# Altium schematic sheet MCU.SchDoc
size A
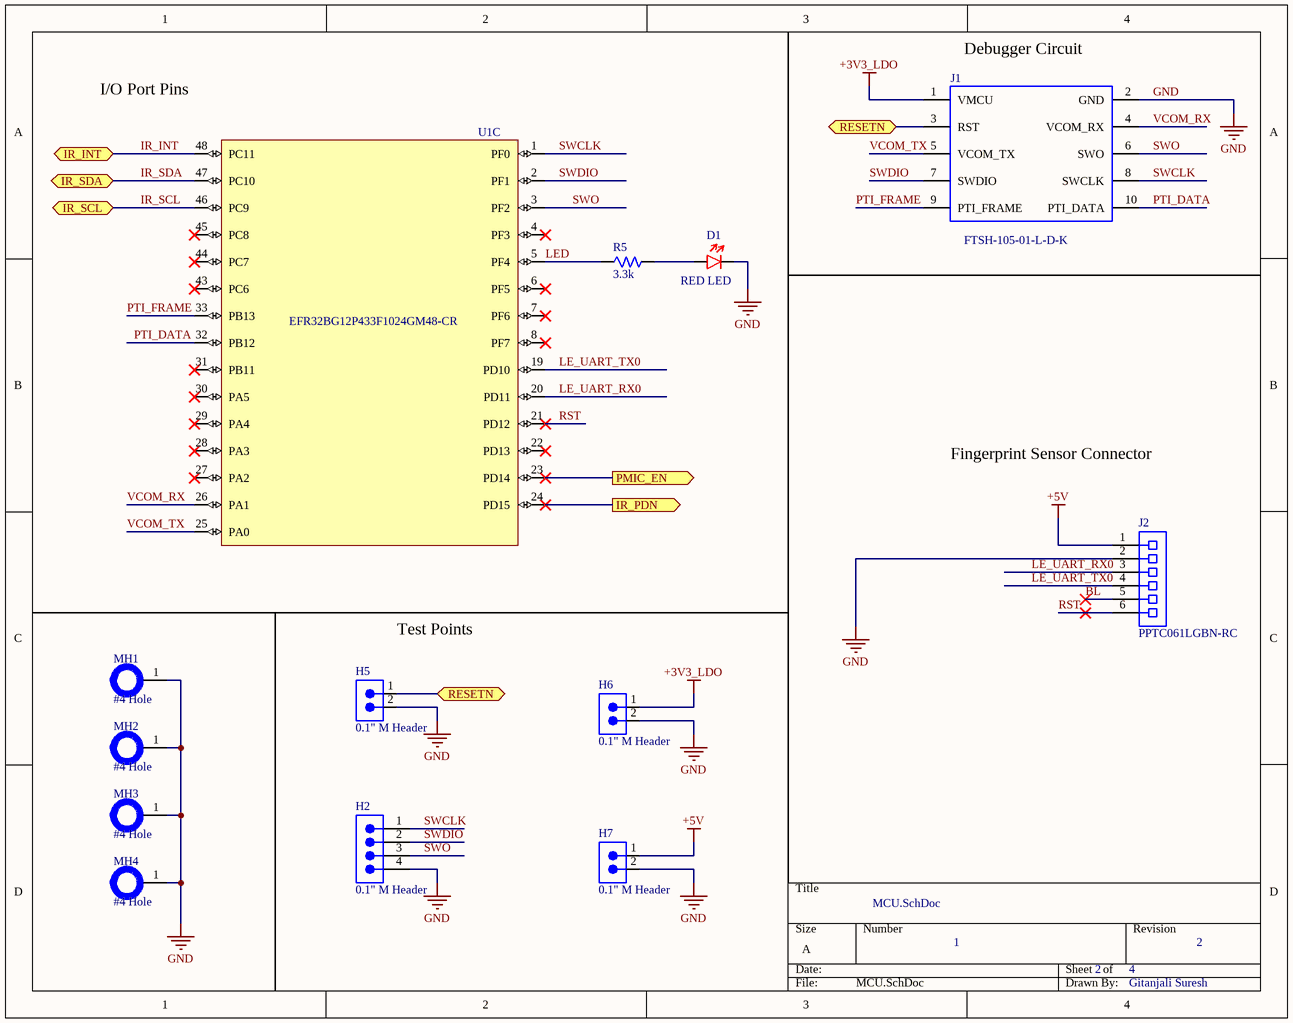
[diagram p0: MCU.SchDoc]

## Parts
D1  RED LED  [LED_0603_GRN_WL-SMCW]
H2  0.1" M Header  [4-PIN_MALE_HEADER_01-IN]
H5  0.1" M Header  [77311-118-02LF_AMP]
H6  0.1" M Header  [77311-118-02LF_AMP]
H7  0.1" M Header  [77311-118-02LF_AMP]
J1  FTSH-105-01-L-D-K  [SAMTEC_FTSH-105-01-L-D-K]
J2  PPTC061LGBN-RC  [SAMTEC-SSQ-106-02-X-S-RA]
MH1  #4 Hole  [HOLE_#4]  (no BOM)
MH2  #4 Hole  [HOLE_#4]  (no BOM)
MH3  #4 Hole  [HOLE_#4]  (no BOM)
MH4  #4 Hole  [HOLE_#4]  (no BOM)
R5  3.3k  [RES_0603_3.3k]
U1  EFR32BG12P433F1024GM48-CR  [QFN50P700X700X90_HS-49N]  (part C of 3)

## Ports
IR_INT (bidir), IR_PDN (out), IR_SCL (bidir), IR_SDA (bidir), PMIC_EN (out), RESETN (bidir)

## Nets
+3V3_LDO: H6.1 J1.1(VMCU)
+5V: H7.1 J2.1(VCC)
GND: D1.2 H2.4 H5.2 H6.2 H7.2 J1.2(GND) J2.2(GND) MH1.1 MH2.1 MH3.1 MH4.1
BL: J2.5(BL)
IR_INT: U1.48(PC11) ; port IR_INT
IR_PDN: U1.24(PD15) ; port IR_PDN
IR_SCL: U1.46(PC9) ; port IR_SCL
IR_SDA: U1.47(PC10) ; port IR_SDA
LE_UART_RX0: J2.3(TXD) U1.20(PD11)
LE_UART_TX0: J2.4(RXD) U1.19(PD10)
LED: R5.1 U1.5(PF4)
PMIC_EN: U1.23(PD14) ; port PMIC_EN
PTI_DATA: J1.10(PTI_DATA) U1.32(PB12)
PTI_FRAME: J1.9(PTI_FRAME) U1.33(PB13)
RESETN: H5.1 J1.3(RST) ; port RESETN
RST: J2.6(RST) U1.21(PD12)
SWCLK: H2.1 J1.8(SWCLK) U1.1(PF0)
SWDIO: H2.2 J1.7(SWDIO) U1.2(PF1)
SWO: H2.3 J1.6(SWO) U1.3(PF2)
VCOM_RX: J1.4(VCOM_RX) U1.26(PA1)
VCOM_TX: J1.5(VCOM_TX) U1.25(PA0)
NetD1_1: D1.1 R5.2

Not connected (* = marked no-connect by the designer): U1 4(PF3)* 6(PF5)* 7(PF6)* 8(PF7)* 22(PD13)* 27(PA2)* 28(PA3)* 29(PA4)* 30(PA5)* 31(PB11)* 43(PC6)* 44(PC7)* 45(PC8)*

## Notes on the sheet
- I/O Port Pins
- (near J1) Debugger Circuit
- Fingerprint Sensor Connector
- Test Points
- 1
- 2
- 4
- Gitanjali Suresh

## Library data of the parts
D1 = L1CU-RED1000000000: LED LUXEON CZ RED SMD; Manufacturer: Wurth Electronics; Manufacturer Part Number: 150060GS75000; Color: Green; Wavelength: 520nm; Viewing Angle: 140°; Lens Style: Clear,Rectangular; Luminous Intensity: 430mcd; Forward Current: 30mA; Forward Voltage: 3.2V; Test Current: 20mA; RoHS: Yes; Category: LEDs; Stock 1: 94535; Pricing 1: 1=0.14000, 50=0.13300, 100=0.11400, 500=0.09900 (USD); Mount: Surface Mount; Case/Package: 0603; Case Code (Metric): 1608; Case Code (Imperial): 0603; Min Operating Temperature: -40°C; Max Operating Temperature: 85°C; Package Quantity: 4000; Packaging: Tape and Reel; Dominant Wavelength: 520nm; Length: 1.6mm; Height: 0.7mm; Width: 0.8mm; REACH SVHC: Unknown; Lead Free: Lead Free; ComponentLink1URL: https://datasheet.ciiva.com/29562/150060gs75000-29562868.pdf?src-supplier=Digi-Key; ComponentLink1Description: https://datasheet.ciiva.com/29562/150060gs75000-29562868.pdf?src-supplier=Digi-Key; ComponentLink2URL: https://datasheet.ciiva.com/29279/759427-da-01-en-chipled-0603-w-kl-gruen-150060gs75000-29279201.pdf?src-supplier=Conrad; ComponentLink2Description: https://datasheet.ciiva.com/29279/759427-da-01-en-chipled-0603-w-kl-gruen-150060gs75000-29279201.pdf?src-supplier=Conrad; ComponentLink3URL: https://datasheet.ciiva.com/29562/150060gs75000-29562870.pdf?src-supplier=Digi-Key; ComponentLink3Description: https://datasheet.ciiva.com/29562/150060gs75000-29562870.pdf?src-supplier=Digi-Key; ComponentLink4URL: https://datasheet.ciiva.com/29562/150060gs75000-29562869.pdf?src-supplier=Digi-Key; ComponentLink4Description: https://datasheet.ciiva.com/29562/150060gs75000-29562869.pdf?src-supplier=Digi-Key; Supplier 1: Digi-Key; Supplier Part Number 1: 1416-2040-1-ND
H2 = PRPC004SAAN-RC: CONN HEADER VERT 4POS 2.54MM; Manufacturer: Sullins; Connector Type: Header, Unshrouded, Breakaway; Number of Positions: 4; Number of Positions Loaded: All; Pitch: 0.100" (2.54mm); Online Catalog: 0.100" (2.54mm) Pitch Connector Headers; Other Names: S9510E-04  S9510E-04-ND; Supplier 1: Digi-Key; Manufacturer Part Number: PRPC004SAAN-RC; Stock 1: 6306; Pricing 1: 1=0.15, 10=0.146, 25=0.1084, 50=0.0928, 100=0.0898, 250=0.0774, 500=0.0743 (USD); Standard Package: 1; Category: Connectors, Interconnects; Family: Rectangular Connectors - Headers, Male Pins; Series: -; Packaging: Bulk; Contact Type: Male Pin; Number of Rows: 1; Row Spacing: -; Contact Mating Length: 0.230" (5.84mm); Mounting Type: Through Hole; Termination: Solder; Fastening Type: -; Features: -; Contact Finish: Gold; Contact Finish Thickness: Flash; Color: Black; ComponentLink1URL: https://media.digikey.com/PDF/Data%20Sheets/Sullins%20PDFs/xRxCzzzSxxN-RC_ST_11635-B.pdf?src-supplier=Digi-Key; ComponentLink1Description: https://media.digikey.com/PDF/Data%20Sheets/Sullins%20PDFs/xRxCzzzSxxN-RC_ST_11635-B.pdf?src-supplier=Digi-Key; Supplier Part Number 1: S1011EC-04-ND
H5-H7 = 77311-118-02LF: Test point; Manufacturer: Amphenol ICC / FCI; Supplier 1: Digi-Key; Manufacturer Part Number: 77311-118-02LF; RoHS: No; Category: Headers and Wire Housings; Stock 1: 29534; Pricing 1: 1=0.19000, 10=0.18200, 100=0.12580, 500=0.10648, 1000=0.08712, 5000=0.07744, 10000=0.07018 (USD); Supplier Part Number 1: 609-4434-ND
J1 = FTSH-105-01-L-D-K: 10-pin Mini Simplicity Connector, 1.27 mm, 10 Contacts, Header, FTSH Series, Through Hole, 2 Rows - Board-To-Board Connector, 1.27 mm, 10 Contacts, Header, FTSH Series, Through Hole, 2 Rows; Manufacturer: Samtec; Number of Contacts: 10; Gender: Male; Connector Type: Male Pin; Pitch: 1.27mm; Row Spacing: 0.05inch; Supplier 1: Digi-Key; Manufacturer Part Number: FTSH-105-01-L-D-K; RoHS: Yes; Category: Headers and Wire Housings; Stock 1: 2511; Pricing 1: 1=2.73000, 10=2.61600, 100=2.18000, 500=1.85300, 1000=1.58050, 5000=1.41700 (USD); Mount: Through Hole; Contact Plating: Gold; Housing Material: Polymer; Housing Color: Black; Contact Material: Bronze; Color: Black; Min Operating Temperature: -55°C; Max Operating Temperature: 125°C; Termination: Solder; Number of Rows: 2; Packaging: Rail/Tube; Number of Positions: 10; Orientation: Straight; Package Quantity: 1; Length: 6.35mm; Contact Mating Length: 0.12inch; Depth: 3.43mm; Radiation Hardening: No; ComponentLink1URL: https://datasheet.ciiva.com/739/ftsh-1xx-xx-xxx-d-xx-mkt-739003.pdf?src-supplier=Digi-Key; ComponentLink1Description: https://datasheet.ciiva.com/739/ftsh-1xx-xx-xxx-d-xx-mkt-739003.pdf?src-supplier=Digi-Key; Supplier Part Number 1: SAM8798-ND
J2 = PPTC061LGBN-RC: Conn Socket Strip SKT 6 POS 2.54mm Solder RA SMD Automotive Tube; Manufacturer: Samtec; Manufacturer Part Number: SSM-106-L-SH; Number of Contacts: 6; Contact Resistance: 10mR; Max Voltage Rating (AC): 450V; Max Current Rating: 6.9A; Gender: Receptacle; Connector Type: Receptacle,Socket; RoHS: Yes; Category: Headers and Wire Housings; Stock 1: 228; Pricing 1: 1=2.05000, 10=1.79000, 25=1.67000, 100=1.63000, 250=1.50000, 500=1.26000 (USD); Contact Plating: Gold; Contact Material: Bronze; Color: Black; Housing Color: Black; Housing Material: Polymer; Min Operating Temperature: -55°C; Max Operating Temperature: 125°C; Number of Rows: 1; Termination: Solder; Packaging: Rail/Tube; Orientation: Horizontal; Current Rating: 6.9A; Number of Positions: 6; Voltage Rating: 450V; Length: 15.24mm; Pitch: 2.54mm; Depth: 8.13mm; Radiation Hardening: No; Lead Free: Lead Free; REACH SVHC: No SVHC; ComponentLink1URL: https://datasheet.ciiva.com/25617/0900766b81159465-25617416.pdf?src-supplier=RSComponents; ComponentLink1Description: https://datasheet.ciiva.com/25617/0900766b81159465-25617416.pdf?src-supplier=RSComponents; ComponentLink2URL: https://datasheet.ciiva.com/746/ssm-1xx-xxx-xx-xx-xx-x-xx-xx-mkt-746688.pdf?src-supplier=Digi-Key; ComponentLink2Description: https://datasheet.ciiva.com/746/ssm-1xx-xxx-xx-xx-xx-x-xx-xx-mkt-746688.pdf?src-supplier=Digi-Key; Supplier 1: Digi-Key; Supplier Part Number 1: S5442-ND
MH1-MH4 = HOLE_#4
R5 = SDR03EZPF3301: RES SMD 3.3 KOHM 1% 0.3W 0603; Manufacturer: Yageo; Manufacturer Part Number: RC0201FR-07100RL; Resistance: 100R; Temperature Coefficient: 200ppm/°C; Power Rating: 50mW; Voltage Rating: 25V; RoHS: Yes; Category: Chip SMD Resistors; Stock 1: 274418; Pricing 1: 1=0.10000, 10=0.03700, 100=0.01500, 1000=0.00673, 2500=0.00584, 5000=0.00483 (USD); Case/Package: 0201; Contact Plating: Tin,Matte; Case Code (Metric): 0603; Case Code (Imperial): 0201; Min Operating Temperature: -55°C; Max Operating Temperature: 125°C; Tolerance: 1%; Resistor Type: Thick Film; Packaging: Tape and Reel; Package Quantity: 1; Max Power Dissipation: 50mW; Number of Terminations: 2; Termination: SMD/SMT; Features: Moisture Resistant; Length: 0.024inch; Height: 0.01inch; Width: 0.012inch; Radiation Hardening: No; REACH SVHC: Unknown; Lead Free: Lead Free; ComponentLink1URL: https://datasheet.ciiva.com/2560/pyu-r-int-thick-7-2560866.pdf?src-supplier=Digi-Key; ComponentLink1Description: https://datasheet.ciiva.com/2560/pyu-r-int-thick-7-2560866.pdf?src-supplier=Digi-Key; ComponentLink2URL: https://datasheet.ciiva.com/28395/pyu-rc0201-51-rohs-l-8-28395391.pdf?src-supplier=Avnet+Europe; ComponentLink2Description: https://datasheet.ciiva.com/28395/pyu-rc0201-51-rohs-l-8-28395391.pdf?src-supplier=Avnet+Europe; ComponentLink3URL: https://datasheet.ciiva.com/2560/pyu-r-int-thick-7-2560865.pdf?src-supplier=Digi-Key; ComponentLink3Description: https://datasheet.ciiva.com/2560/pyu-r-int-thick-7-2560865.pdf?src-supplier=Digi-Key; ComponentLink4URL: https://datasheet.ciiva.com/2560/pyu-r-int-thick-7-2560867.pdf?src-supplier=Digi-Key; ComponentLink4Description: https://datasheet.ciiva.com/2560/pyu-r-int-thick-7-2560867.pdf?src-supplier=Digi-Key; ComponentLink5URL: https://datasheet.ciiva.com/16855/pyu-rc0201-51-rohs-l-8-16855781.pdf?src-supplier=Avnet+Europe; ComponentLink5Description: https://datasheet.ciiva.com/16855/pyu-rc0201-51-rohs-l-8-16855781.pdf?src-supplier=Avnet+Europe; ComponentLink6URL: https://datasheet.ciiva.com/8887/pyu-rc0201-51-rohs-l-8-8887865.pdf?src-supplier=Avnet; ComponentLink6Description: https://datasheet.ciiva.com/8887/pyu-rc0201-51-rohs-l-8-8887865.pdf?src-supplier=Avnet; Supplier 1: Digi-Key; Supplier Part Number 1: 511-1715-1-ND
U1 = EFR32BG12P433F1024GM48-CR: Blue Gecko EFR32BG13; Manufacturer: Silicon Labs; Supplier 1: Digi-Key; Manufacturer Part Number: EFR32BG12P433F1024GM48-CR; RoHS: No; Stock 1: 4670; Pricing 1: 1=11.65000, 25=9.59720, 100=8.68300, 1000=6.39800 (USD); Supplier Part Number 1: 336-6197-1-ND